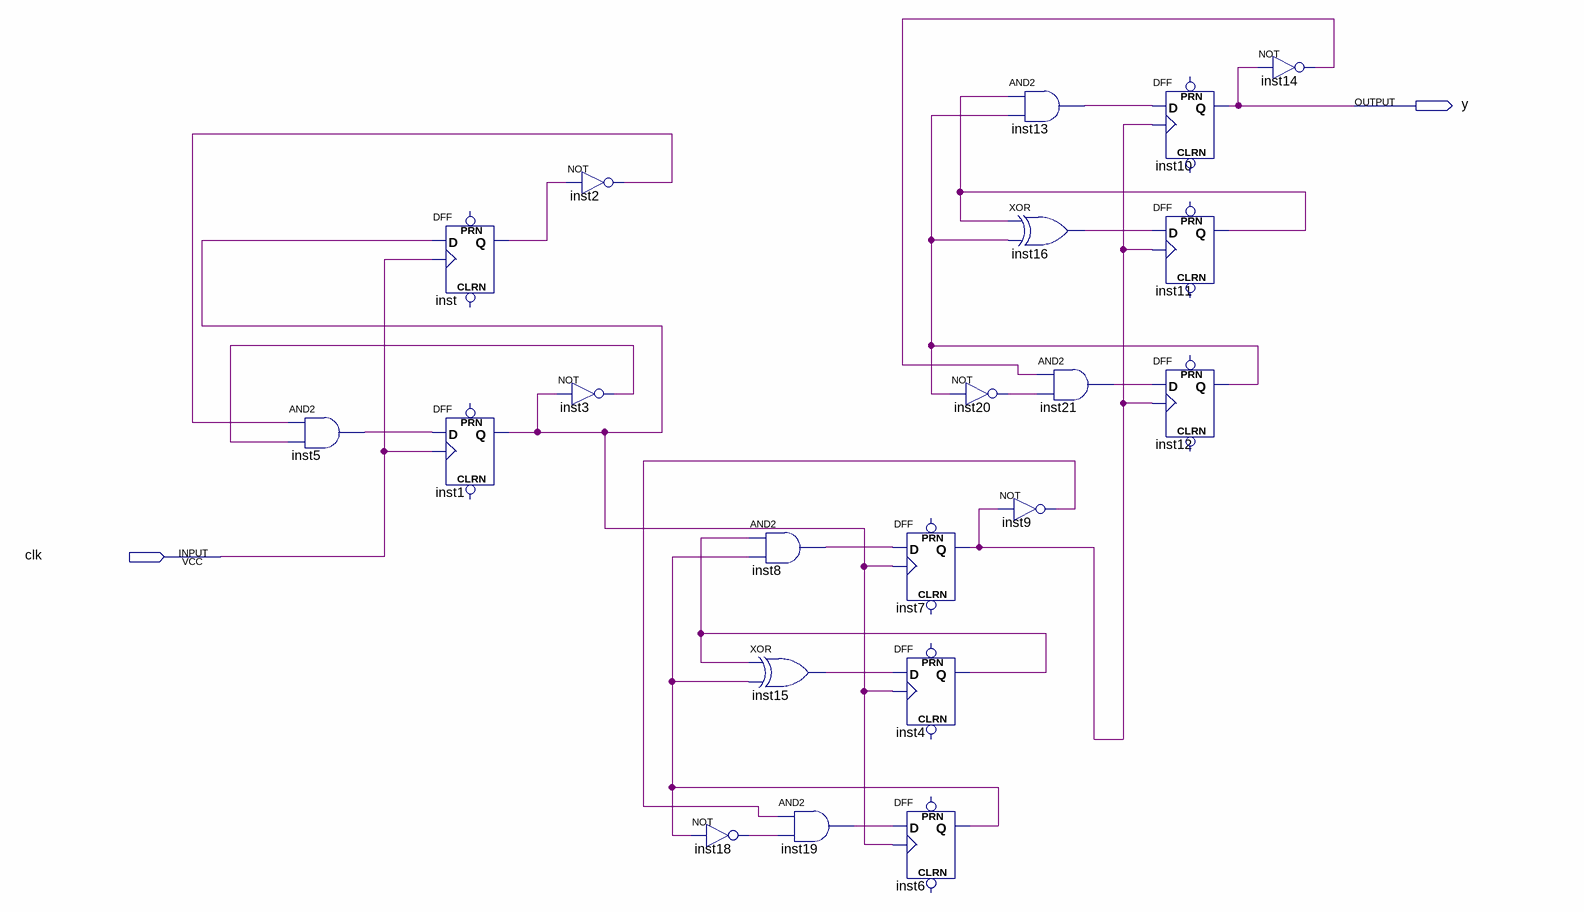
[diagram p0: schematic sheet]
// Quartus schematic 75Xdec.bdf as structural Verilog: 21 symbols, 2 pins
module \75Xdec  (
  input  clk,
  output y
);

  wire inst1_q, inst2_out, inst3_out, inst4_q, inst5_out, inst6_q, inst7_q, inst8_out, inst9_out, inst11_q,
       inst12_q, inst13_out, inst14_out, inst15_out, inst16_out, inst18_out, inst19_out, inst20_out,
       inst21_out, inst_q;

  and inst5 (inst5_out, inst2_out, inst3_out);
  DFF inst (.CLK(clk), .D(inst1_q), .Q(inst_q));  // open: CLRN, PRN
  DFF inst1 (.CLK(clk), .D(inst5_out), .Q(inst1_q));  // open: CLRN, PRN
  not inst2 (inst2_out, inst_q);
  not inst3 (inst3_out, inst1_q);
  and inst8 (inst8_out, inst4_q, inst6_q);
  xor inst15 (inst15_out, inst4_q, inst6_q);
  not inst18 (inst18_out, inst6_q);
  and inst19 (inst19_out, inst9_out, inst18_out);
  DFF inst7 (.CLK(inst1_q), .D(inst8_out), .Q(inst7_q));  // open: CLRN, PRN
  DFF inst4 (.CLK(inst1_q), .D(inst15_out), .Q(inst4_q));  // open: CLRN, PRN
  DFF inst6 (.CLK(inst1_q), .D(inst19_out), .Q(inst6_q));  // open: CLRN, PRN
  not inst20 (inst20_out, inst12_q);
  and inst13 (inst13_out, inst11_q, inst12_q);
  xor inst16 (inst16_out, inst11_q, inst12_q);
  and inst21 (inst21_out, inst14_out, inst20_out);
  not inst9 (inst9_out, inst7_q);
  DFF inst10 (.CLK(inst7_q), .D(inst13_out), .Q(y));  // open: CLRN, PRN
  DFF inst11 (.CLK(inst7_q), .D(inst16_out), .Q(inst11_q));  // open: CLRN, PRN
  DFF inst12 (.CLK(inst7_q), .D(inst21_out), .Q(inst12_q));  // open: CLRN, PRN
  not inst14 (inst14_out, y);
endmodule
